# EAGLE design Adafruit Grove and STEMMA QT FeatherWing (EAGLE 9.6.2)
COMPANY: ADAFRUIT INDUSTRIES; DRAWN: KTOWN; REV: A
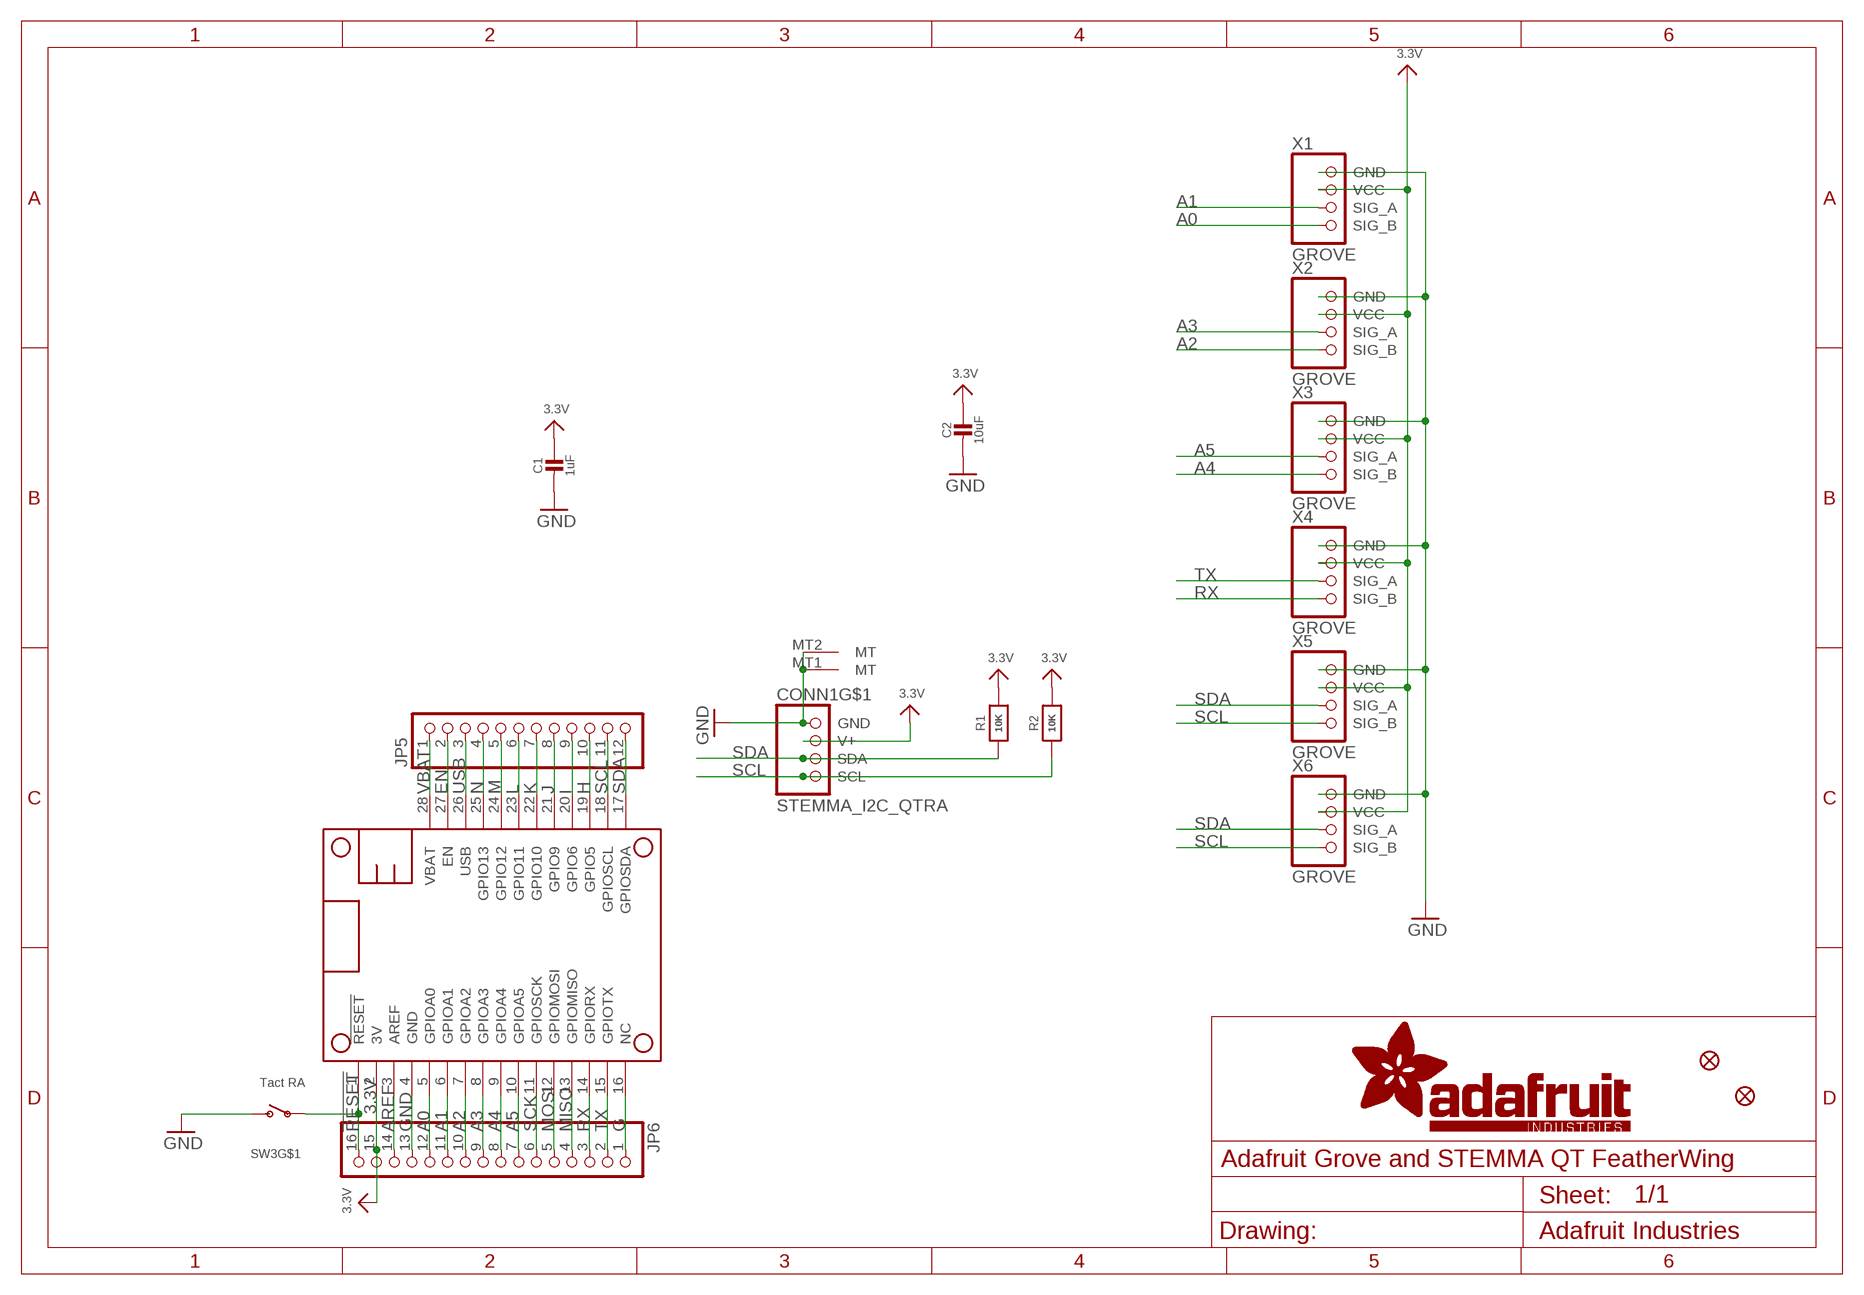
[diagram p0: schematic, sheet 1]

## Parts
C1  1uF  CAP_CERAMIC0603_NO  [0603-NO]
C2  10uF  CAP_CERAMIC0805-NOOUTLINE  [0805-NO]
CONN1  STEMMA_I2C_QTRA  [JST_SH4_RA]
FID1  FIDUCIAL_1MM  [FIDUCIAL_1MM]
FID2  FIDUCIAL_1MM  [FIDUCIAL_1MM]
JP5  HEADER-1X12  [1X12_ROUND]
JP6  HEADER-1X16ROUND  [1X16_ROUND]
MS1  FEATHERWING_NODIM  [FEATHERWING_NODIM]
R1  10K  RESISTOR_0603_NOOUT  [0603-NO]
R2  10K  RESISTOR_0603_NOOUT  [0603-NO]
SW3  Tact RA  SWITCH_SPST_MNT_TACT_RA  [SPST_TACTILE_RA]
X1  GROVE  CON_GROVE_4PIN  [GROVE_SMTV]
X2  GROVE  CON_GROVE_4PIN  [GROVE_SMTV]
X3  GROVE  CON_GROVE_4PIN  [GROVE_SMTV]
X4  GROVE  CON_GROVE_4PIN  [GROVE_SMTV]
X5  GROVE  CON_GROVE_4PIN  [GROVE_SMTV]
X6  GROVE  CON_GROVE_4PIN  [GROVE_SMTV]

## Nets
3.3V: C1.1 C2.1 CONN1.2(V+) JP6.15 MS1.2(3V) R1.2 R2.2 X1.2(VCC) X2.2(VCC) X3.2(VCC) X4.2(VCC) X5.2(VCC) X6.2(VCC)
!RESET: JP6.16 MS1.1(!RESET) SW3.1(P)
A0: JP6.12 MS1.5(GPIOA0) X1.4(SIG_B)
A1: JP6.11 MS1.6(GPIOA1) X1.3(SIG_A)
A2: JP6.10 MS1.7(GPIOA2) X2.4(SIG_B)
A3: JP6.9 MS1.8(GPIOA3) X2.3(SIG_A)
A4: JP6.8 MS1.9(GPIOA4) X3.4(SIG_B)
A5: JP6.7 MS1.10(GPIOA5) X3.3(SIG_A)
AREF: JP6.14 MS1.3(AREF)
EN: JP5.2 MS1.27(EN)
G: JP6.1 MS1.16(NC)
GND: C1.2 C2.2 CONN1.1(GND) CONN1.MT1(MT) CONN1.MT2(MT) JP6.13 MS1.4(GND) SW3.2(S) X1.1(GND) X1.MT1(GND) X1.MT2(GND) X2.1(GND) X2.MT1(GND) X2.MT2(GND) X3.1(GND) X3.MT1(GND) X3.MT2(GND) X4.1(GND) X4.MT1(GND) X4.MT2(GND) X5.1(GND) X5.MT1(GND) X5.MT2(GND) X6.1(GND) X6.MT1(GND) X6.MT2(GND)
H: JP5.10 MS1.19(GPIO5)
I: JP5.9 MS1.20(GPIO6)
J: JP5.8 MS1.21(GPIO9)
K: JP5.7 MS1.22(GPIO10)
L: JP5.6 MS1.23(GPIO11)
M: JP5.5 MS1.24(GPIO12)
MISO: JP6.4 MS1.13(GPIOMISO)
MOSI: JP6.5 MS1.12(GPIOMOSI)
N: JP5.4 MS1.25(GPIO13)
RX: JP6.3 MS1.14(GPIORX) X4.4(SIG_B)
SCK: JP6.6 MS1.11(GPIOSCK)
SCL: CONN1.4(SCL) JP5.11 MS1.18(GPIOSCL) R2.1 X5.4(SIG_B) X6.4(SIG_B)
SDA: CONN1.3(SDA) JP5.12 MS1.17(GPIOSDA) R1.1 X5.3(SIG_A) X6.3(SIG_A)
TX: JP6.2 MS1.15(GPIOTX) X4.3(SIG_A)
USB: JP5.3 MS1.26(USB)
VBAT: JP5.1 MS1.28(VBAT)
Unconnected: SW3.MT1(MT) SW3.MT2(MT)

## Library data of the parts
C1 C2 = microbuilder:CAP_CERAMIC: Ceramic Capacitors For new designs, use the packages preceded by an '_' character since they are more reliable: The following footprints should be used on most boards: _0402 - Standard footprint for regular board layouts _0603 - Standard footprint for regular board layouts _0805 - Standard footprint for regular board layouts _1206 - Standard footprint for regular board layouts For extremely tight-pitch boards where space is at a premium, the following 'micro-pitch' footprints can be used (smaller pads, no silkscreen outline, etc.): _0402MP - Micro-pitch footprint for very dense/compact boards _0603MP - Micro-pitch footprint for very dense/compact boards _0805MP - Micro-pitch footprint for very dense/compact boards _1206MP - Micro-pitch footprint for very dense/compact boards
CONN1 = adafruit_electromech:STEMMA_I2C; LCSC: C145961
FID1 FID2 = microbuilder:FIDUCIAL: Fiducial Alignment Points Various fiducial points for machine vision alignment.; BOM: EXCLUDE
JP5 = microbuilder:HEADER-1X12
JP6 = microbuilder:HEADER-1X16: PIN HEADER
MS1 = microbuilder:FEATHERWING
R1 R2 = microbuilder:RESISTOR: Resistors For new designs, use the packages preceded by an '_' character since they are more reliable: The following footprints should be used on most boards: _0402 - Standard footprint for regular board layouts _0603 - Standard footprint for regular board layouts _0805 - Standard footprint for regular board layouts _1206 - Standard footprint for regular board layouts For extremely tight-pitch boards where space is at a premium, the following 'micro-pitch' footprints can be used (smaller pads, no silkscreen outline, etc.): _0402MP - Micro-pitch footprint for very dense/compact boards _0603MP - Micro-pitch footprint for very dense/compact boards _0805MP - Micro-pitch footprint for very dense/compact boards _1206MP - Micro-pitch footprint for very dense/compact boards
SW3 = adafruit_electromech:SWITCH_SPST_MNT: Switch - SPST 4UCon 19192 (6.7x2.6mm SMT); LCSC: C778159
X1-X6 = adafruit_electromech:CON_GROVE_4PIN: JST 4-Pin Right-Angle Connector 4UConnector: 17312; LCSC: C161188

## Net classes
1 highpower: width 0.305 mm, drill 0.483 mm
2 lowpower: width 0.254 mm, drill 0.483 mm

## Board
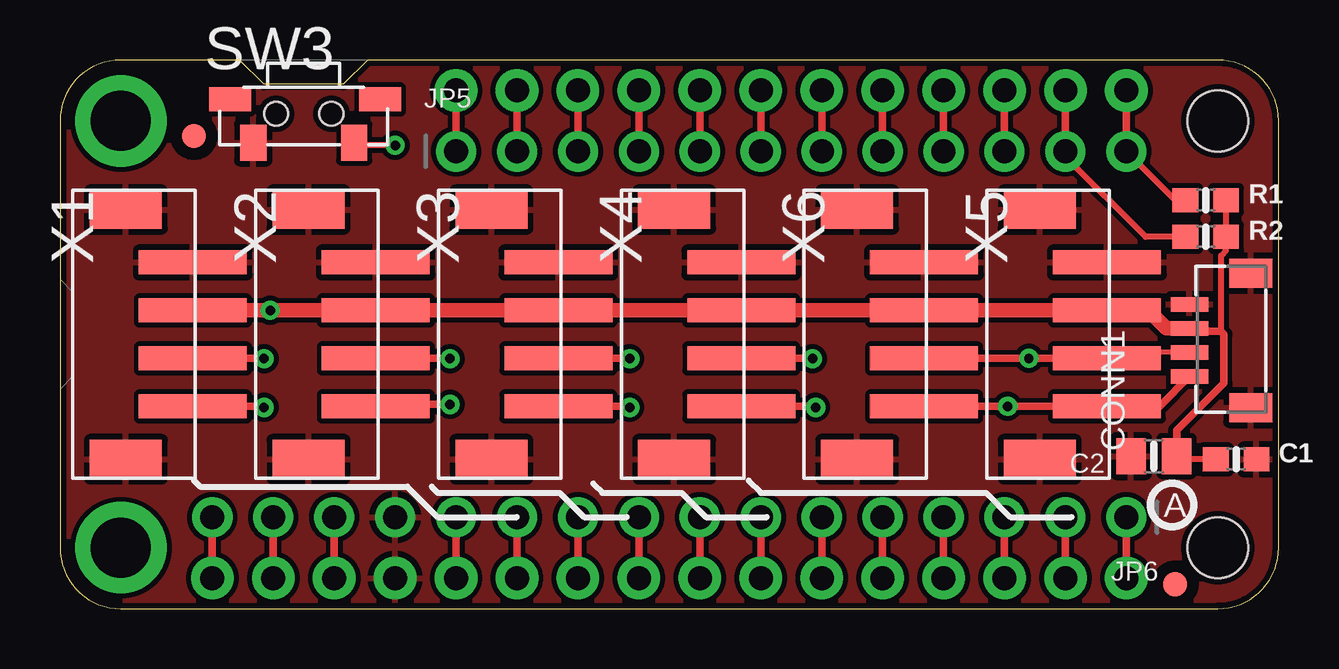
[diagram p1: board, top side]
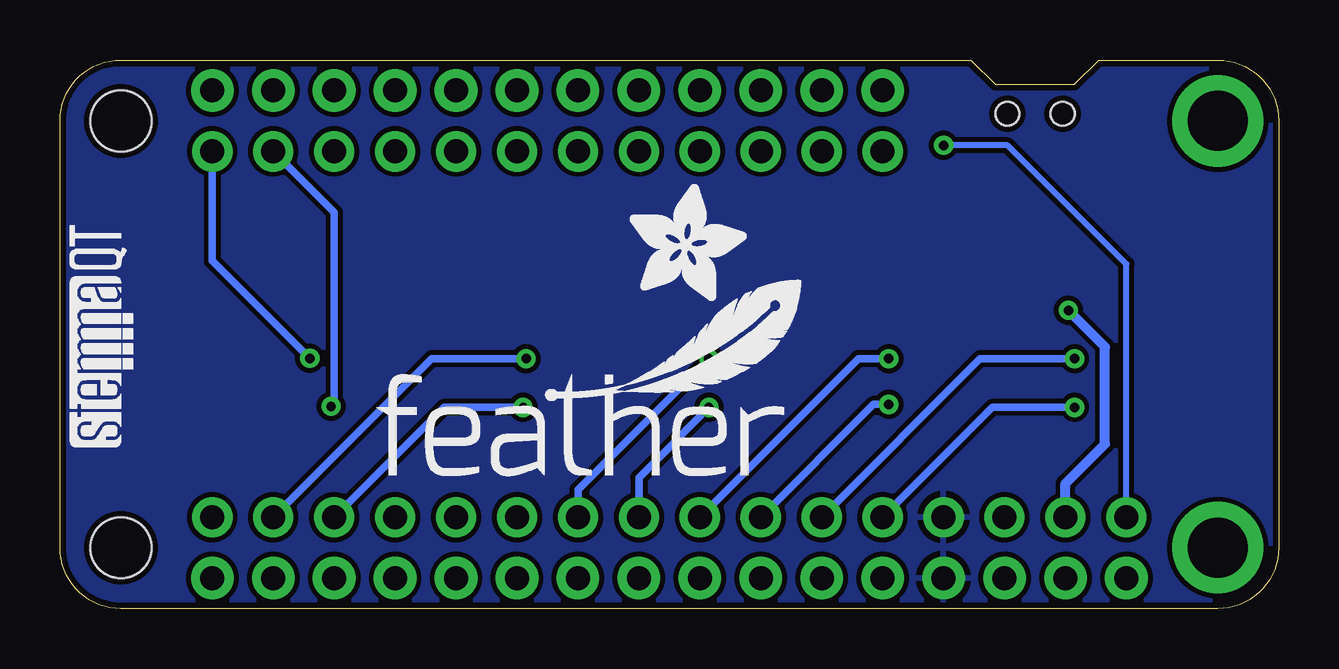
[diagram p2: board, bottom side, seen from below]

Size 50.8 x 22.86 mm. Coordinates in mm from the lower left corner, seen from the top.
Outline: 2.54,0 48.26,0 arc90 50.8,2.54 50.8,20.32 arc90 48.26,22.86 12.83,22.86 11.81,21.84 8.51,21.84 7.49,22.86 2.54,22.86 arc90 0,20.32 0,2.54 arc90 2.54,0
Copper layers (1*16): Top 0.035mm / dielectric 1.5mm / Bottom 0.035mm
Design rules "adafruit *": minimum track width 8mil, minimum drill 15.5mil, track to track 8mil, track to pad 8mil, pad to pad 8mil, via to via 8mil, smd to smd 8mil, copper to edge 10mil, drill to drill 8mil, minimum pad ring 10mil, minimum via ring 8mil, stop-mask expansion 2mil, vias tented up to drill 20mil, thermal gap 10mil

### Footprints (pad centres in the part's own frame; a part is rotated, then mirrored left to right if it is on the bottom)
0603-NO = smd 1.075 x 1: 1 -0.85,0; 2 0.85,0
0805-NO = smd 1.24 x 1.5: 1 -0.95,0; 2 0.95,0
JST_SH4_RA = smd 0.6 x 1.55: 1 1.5,0.924; 2 0.5,0.924; 3 -0.5,0.924; 4 -1.5,0.924 | smd 1.2 x 1.8: MT1 -2.8,-1.624; MT2 2.8,-1.624
FIDUCIAL_1MM = smd 1 x 1: 1 0,0
1X12_ROUND = drill 1 pad 1.676: 1 -13.97,0; 2 -11.43,0; 3 -8.89,0; 4 -6.35,0; 5 -3.81,0; 6 -1.27,0; 7 1.27,0; 8 3.81,0; 9 6.35,0; 10 8.89,0; 11 11.43,0; 12 13.97,0
1X16_ROUND = drill 1 pad 1.676: 1 -19.05,0; 2 -16.51,0; 3 -13.97,0; 4 -11.43,0; 5 -8.89,0; 6 -6.35,0; 7 -3.81,0; 8 -1.27,0; 9 1.27,0; 10 3.81,0; 11 6.35,0; 12 8.89,0; 13 11.43,0; 14 13.97,0; 15 16.51,0; 16 19.05,0
FEATHERWING_NODIM = drill 1 pad 1.778: 1 6.35,1.27; 2 8.89,1.27; 3 11.43,1.27; 4 13.97,1.27; 5 16.51,1.27; 6 19.05,1.27; 7 21.59,1.27; 8 24.13,1.27; 9 26.67,1.27; 10 29.21,1.27; 11 31.75,1.27; 12 34.29,1.27; 13 36.83,1.27; 14 39.37,1.27; 15 41.91,1.27; 16 44.45,1.27; 17 44.45,21.59; 18 41.91,21.59; 19 39.37,21.59; 20 36.83,21.59; 21 34.29,21.59; 22 31.75,21.59; 23 29.21,21.59; 24 26.67,21.59; 25 24.13,21.59; 26 21.59,21.59; 27 19.05,21.59; 28 16.51,21.59 | drill 2.5 pad 3.81: P$1 2.54,20.32; P$2 2.54,2.54 | hole 2.54: 48.26,20.32; 48.26,2.54
SPST_TACTILE_RA = smd 1.1 x 1.5: 1 2.1,-0.9; 2 -2.1,-0.9 | smd 1.75 x 1: MT1 3.175,0.9; MT2 -3.075,0.9 | hole 1: 1.15,0.3; -1.15,0.3
GROVE_SMTV = smd 1 x 4.5: 1 -3,1.73; 2 -1,1.73; 3 1,1.73; 4 3,1.73 | smd 1.6 x 3: MT1 -5.2,-1.07; MT2 5.2,-1.07

### Placement (x,y rotation side)
C1  49.02,6.22 0 top
C2  45.59,6.35 180 top
CONN1  48.01,11.18 90 top
FID1  5.59,19.68 0 top
FID2  46.48,1.02 0 top
JP5  30.48,19.05 0 top
JP6  25.4,3.81 180 top
MS1  0,0 0 top
PLABEL0  [PLABEL0]  6.99,5.84 0 top
PLABEL1  [PLABEL1]  6.99,7.11 0 top
PLABEL2  [PLABEL2]  14.61,7.11 0 top
PLABEL3  [PLABEL3]  14.61,5.84 0 top
PLABEL4  [PLABEL4]  22.23,5.84 0 top
PLABEL5  [PLABEL5]  22.23,7.11 0 top
PLABEL6  [PLABEL6]  29.84,5.84 0 top
PLABEL7  [PLABEL7]  29.84,7.11 0 top
PLABEL8  [PLABEL8]  37.47,5.84 0 top
PLABEL9  [PLABEL9]  37.47,7.11 0 top
PLABEL10  [PLABEL10]  36.96,16.64 90 top
PLABEL11  [PLABEL11]  44.58,16.64 90 top
PLABEL12  [PLABEL12]  29.21,16.76 90 top
PLABEL13  [PLABEL13]  21.72,16.64 90 top
PLABEL14  [PLABEL14]  14.1,16.64 90 top
PLABEL15  [PLABEL15]  6.48,16.64 90 top
PLABEL16  [PLABEL16]  10.41,18.16 0 top
PLABEL17  [PLABEL17]  49.91,17.02 90 top
PLABEL18  [PLABEL18]  47.37,12.57 0 bottom
PLABEL19  [PLABEL19]  18.54,4.06 0 bottom
R1  47.75,17.02 0 top
R2  47.75,15.49 0 top
SW3  10.16,20.32 0 top
U$5  [FEATHERLOGO_MED]  37.72,5.46 0 bottom
U$7  [ADAFRUIT_5MM]  27.05,12.83 0 bottom
U$8  [PCBFEAT-REV-040]  46.35,4.32 0 top
U$11  [STEMMAQT]  47.75,6.73 90 bottom
X1  3.81,11.43 270 top
X2  11.43,11.43 270 top
X3  19.05,11.43 270 top
X4  26.67,11.43 270 top
X5  41.91,11.43 270 top
X6  34.29,11.43 270 top

### Tracks (layer width: path | path; a pad name or v marks a point on that pad's centre or on a via)
3.3V  (via drill 0.39)
  Top 0.254: C1.1 46.67,6.22 C2.1 | R1.2 R2.2 48.6,14.91 48.4,14.71 48.4,11.55
  Top 0.305: MS1.2 JP6.15 | C2.1 46.54,7.43 48.51,9.4 48.51,11.43 48.4,11.55 47.21,11.55 CONN1.2
  Top 0.61: X1.2 v8.76,12.43 X2.2 X3.2 X4.2 X6.2 X5.2 45.35,12.43 46.11,11.68 CONN1.2
  Bottom 0.406: JP6.15 8.89,5.21 7.24,6.86 7.24,10.91 v8.76,12.43
!RESET  (via drill 0.39)
  Top 0.254: v13.97,19.3 12.38,19.3 SW3.1
  Top 0.305: JP6.16 MS1.1
  Bottom 0.254: JP6.16 6.35,14.35 11.3,19.3 v13.97,19.3
A0  (via drill 0.39)
  Top 0.305: X1.4 8.46,8.43 v8.51,8.38 | JP6.12 MS1.5
  Bottom 0.305: v8.51,8.38 11.94,8.38 JP6.12
A1  (via drill 0.39)
  Top 0.305: X1.3 8.49,10.43 v8.51,10.41 | MS1.6 JP6.11
  Bottom 0.305: v8.51,10.41 12.45,10.41 JP6.11
A2  (via drill 0.39)
  Top 0.203: X2.4 13.24,8.51 14.51,8.51
  Top 0.305: 14.51,8.51 v16.26,8.51 | JP6.10 MS1.7
  Bottom 0.305: v16.26,8.51 16.89,8.51 JP6.10
A3  (via drill 0.39)
  Top 0.305: X2.3 16.24,10.43 v16.26,10.41 | MS1.8 JP6.9
  Bottom 0.305: v16.26,10.41 17.53,10.41 JP6.9
A4  (via drill 0.39)
  Top 0.305: X3.4 23.7,8.43 v23.75,8.38 | JP6.8 MS1.9
  Bottom 0.305: v23.75,8.38 26.67,5.46 JP6.8
A5  (via drill 0.39)
  Top 0.305: X3.3 23.73,10.43 v23.75,10.41 | MS1.10 JP6.7
  Bottom 0.305: v23.75,10.41 29.21,4.95 JP6.7
AREF
  Top 0.305: JP6.14 MS1.3
EN
  Top 0.305: MS1.27 JP5.2
G
  Top 0.305: MS1.16 JP6.1
GND
  pour Bottom: 0,22.86 50.8,22.86 50.8,0 0,0
  pour Top: 0,22.86 50.8,22.86 50.8,0 0,0
H
  Top 0.305: MS1.19 JP5.10
I
  Top 0.305: JP5.9 MS1.20
J
  Top 0.305: MS1.21 JP5.8
K
  Top 0.305: JP5.7 MS1.22
L
  Top 0.305: MS1.23 JP5.6
M
  Top 0.305: MS1.24 JP5.5
MISO
  Top 0.305: JP6.4 MS1.13
MOSI
  Top 0.305: MS1.12 JP6.5
N
  Top 0.305: MS1.25 JP5.4
RX  (via drill 0.39)
  Top 0.305: X4.4 31.45,8.43 v31.5,8.38 | MS1.14 JP6.3
  Bottom 0.305: v31.5,8.38 34.8,8.38 JP6.3
SCK
  Top 0.305: JP6.6 MS1.11
SCL  (via drill 0.39)
  Top 0.254: R2.1 45.25,15.49 41.91,18.84 JP5.11
  Top 0.305: MS1.18 JP5.11 | CONN1.4 45.84,8.43 X5.4 v39.5,8.43 X6.4
  Bottom 0.305: JP5.11 39.37,16.51 39.37,8.56 v39.5,8.43
SDA  (via drill 0.39)
  Top 0.203: CONN1.3 43.89,10.68 X5.3 42.81,10.43 42.8,10.41
  Top 0.254: R1.1 46.48,17.02 JP5.12
  Top 0.305: MS1.17 JP5.12 | CONN1.3 47.03,10.62 | 43.53,10.54 43.05,10.54 42.93,10.41 42.8,10.41 42.78,10.43 v40.39,10.43 X6.3
  Bottom 0.305: JP5.12 44.45,14.49 v40.39,10.43
TX  (via drill 0.39)
  Top 0.305: X4.3 31.35,10.43 v31.37,10.41 | JP6.2 MS1.15
  Bottom 0.305: v31.37,10.41 35.31,10.41 JP6.2
USB
  Top 0.305: MS1.26 JP5.3
VBAT
  Top 0.305: MS1.28 JP5.1

### Text on the board
Pinguin_tBackup: Reset | A/D | A/D | A/D | UART | I2C | I2C | I2C QT | OUT | IN | B | A | A1 | A3 | A5 | TX | SDA | A0 | A2 | A4 | RX | SCL
Pinguin_bBackup: RST | OUT | IN | Grove Connect / FeatherWing | NeoKey 2 / FeatherWing | KEYB | A | KEYA | B | Port #1: A0 & A1 / Port #2: A2 & A3 / Port #3: A4 & A5 / (or 24/25 on RP2040) / Port #4: Serial UART / Port #5/#6: I2C / 3.3V Power/Logic